# Altium project HV.PrjPcb
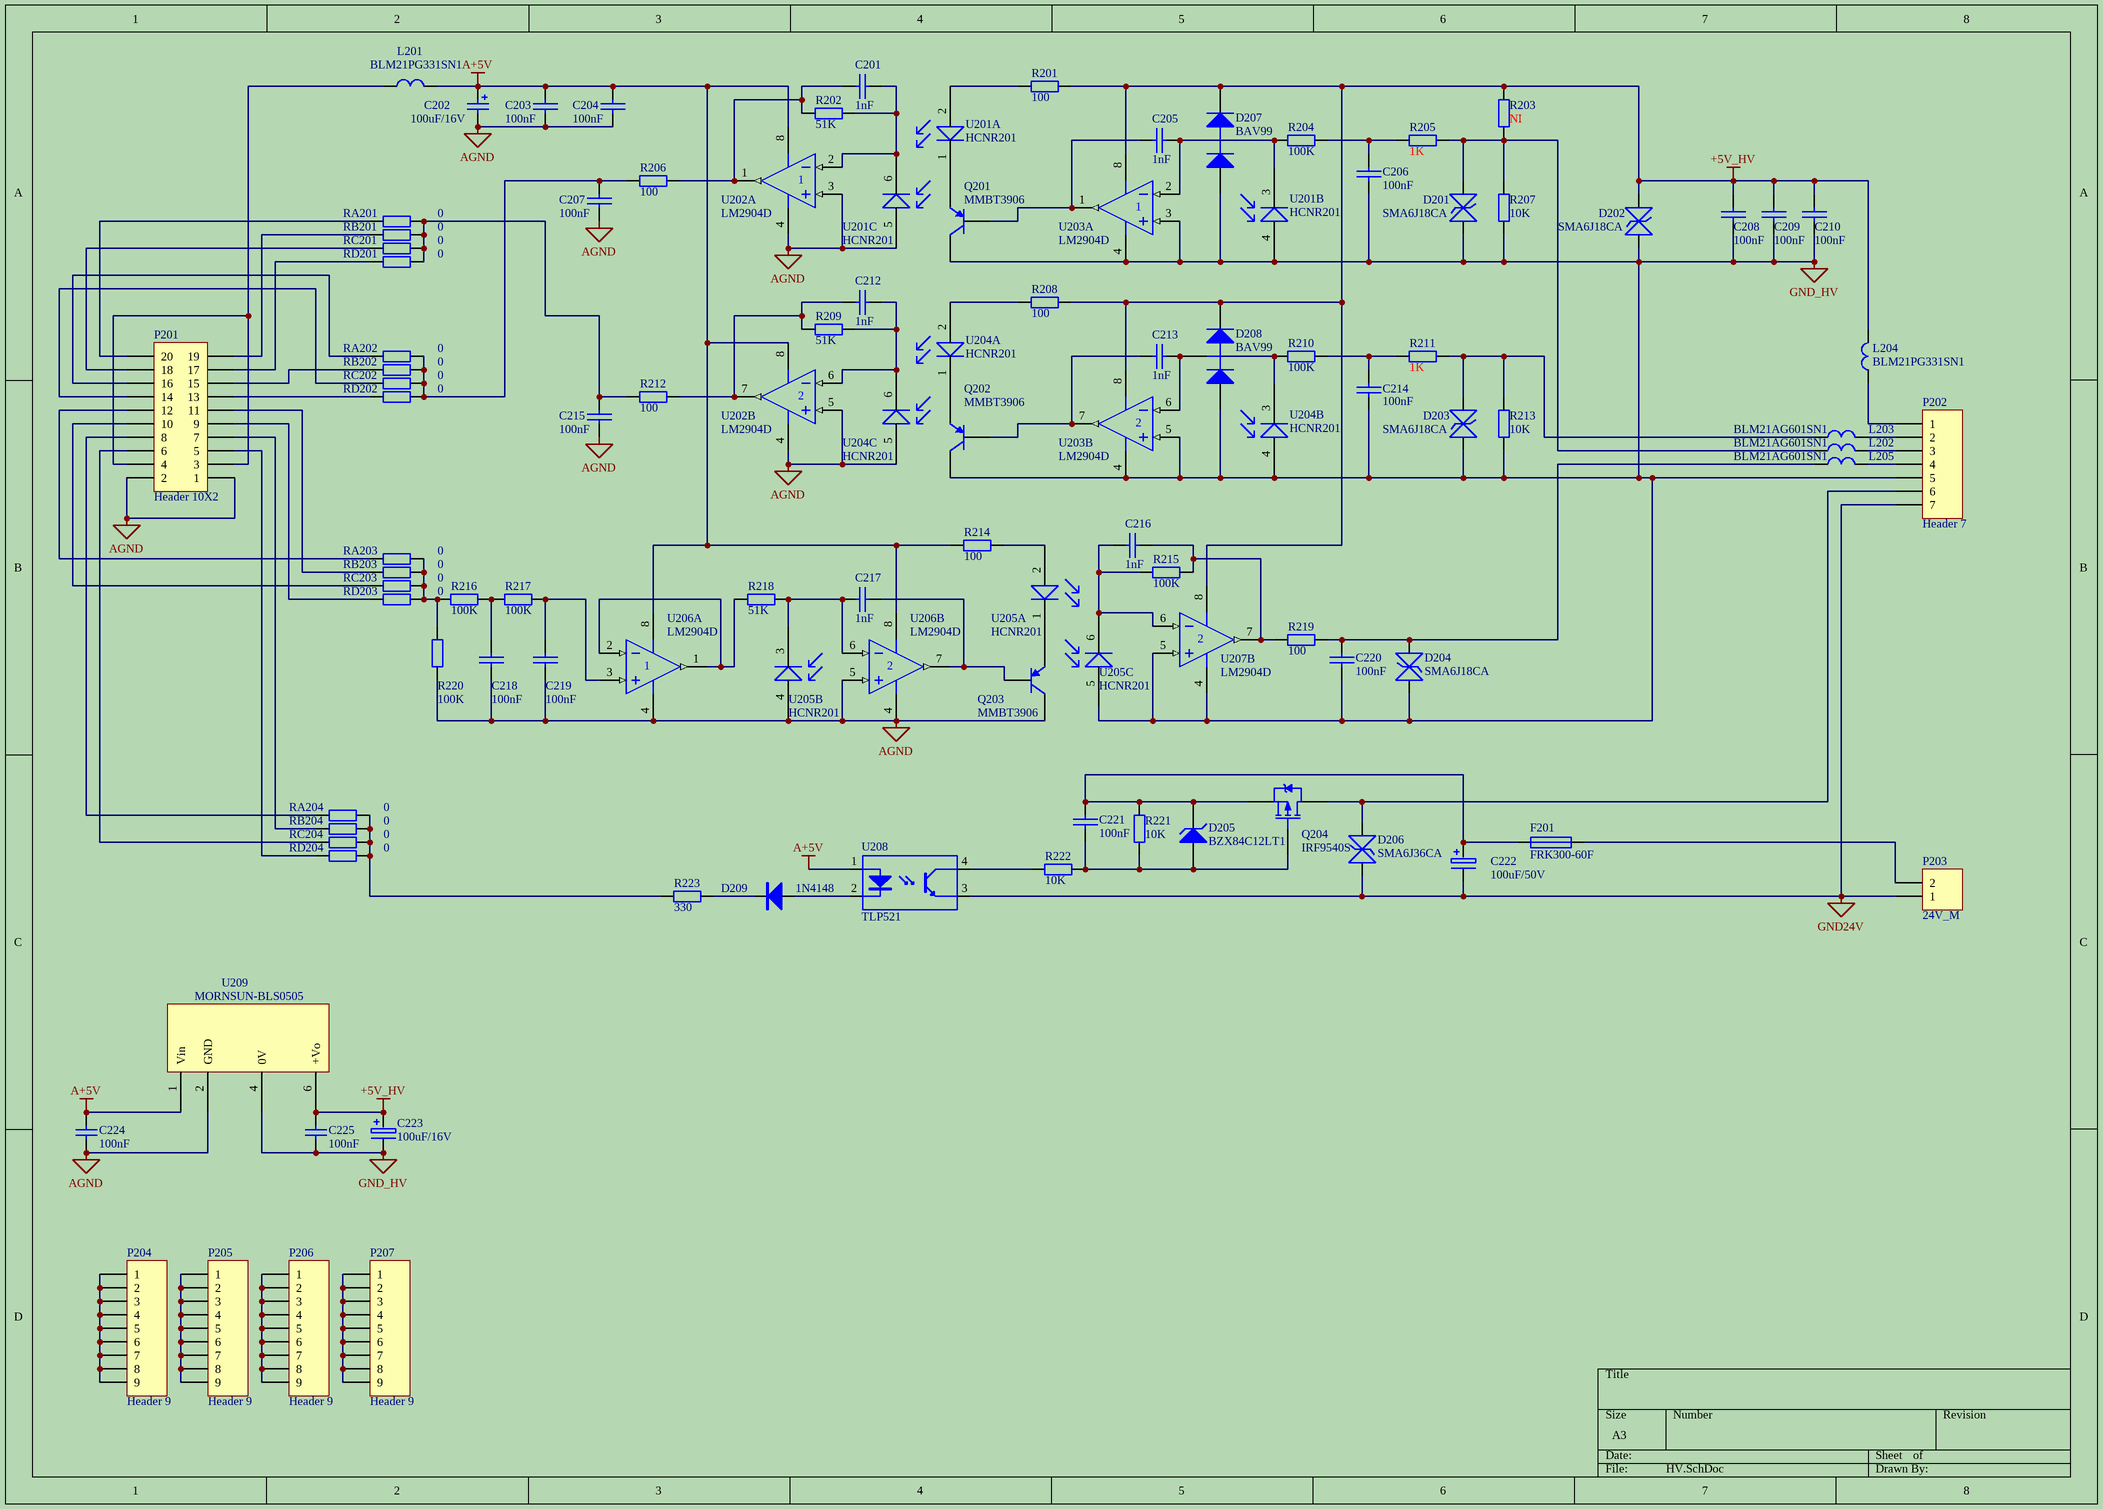
[diagram p0: HV.SchDoc]
1 sheet, 98 parts. Net scope: global (net labels, ports and power ports of the same name join across sheets).
Board file: HV.PcbDoc

## Sheet HV.SchDoc
size A3

### Parts
C201  1nF  [C0805]
C202  100uF/16V  [CD1/2]
C203  100nF  [C0805]
C204  100nF  [C0805]
C205  1nF  [C0805]
C206  100nF  [C0805]
C207  100nF  [C0805]
C208  100nF  [C0805]
C209  100nF  [C0805]
C210  100nF  [C0805]
C212  1nF  [C0805]
C213  1nF  [C0805]
C214  100nF  [C0805]
C215  100nF  [C0805]
C216  1nF  [C0805]
C217  1nF  [C0805]
C218  100nF  [C0805]
C219  100nF  [C0805]
C220  100nF  [C0805]
C221  100nF  [C0805]
C222  100uF/50V  [CD2/4]
C223  100uF/16V  [CD1/2]
C224  100nF  [C0805]
C225  100nF  [C0805]
D201  SMA6J18CA  [SMA]
D202  SMA6J18CA  [SMA]
D203  SMA6J18CA  [SMA]
D204  SMA6J18CA  [SMA]
D205  BZX84C12LT1  [318-07]
D206  SMA6J36CA  [SMA]
D207  BAV99  [SOT-23]
D208  BAV99  [SOT-23]
D209  1N4148  [D1206]
F201  FRK300-60F  [RAD-0.2]
L201  BLM21PG331SN1  [L0805]
L202  BLM21AG601SN1  [L0805]
L203  BLM21AG601SN1  [L0805]
L204  BLM21PG331SN1  [L0805]
L205  BLM21AG601SN1  [L0805]
P201  Header 10X2  [IDC20-EJ]
P202  Header 7  [3.96-7]
P203  24V_M  [3.96-2]
P204  Header 9  [LK]
P205  Header 9  [LK]
P206  Header 9  [LK]
P207  Header 9  [LK]
Q201  MMBT3906  [SOT23_N]
Q202  MMBT3906  [SOT23_N]
Q203  MMBT3906  [SOT23_N]
Q204  IRF9540S  [D2PAK_N]
R201  100  [R0805]
R202  51K  [R0805]
R203  NI  [R0805]
R204  100K  [R0805]
R205  1K  [R0805]
R206  100  [R0805]
R207  10K  [R0805]
R208  100  [R0805]
R209  51K  [R0805]
R210  100K  [R0805]
R211  1K  [R0805]
R212  100  [R0805]
R213  10K  [R0805]
R214  100  [R0805]
R215  100K  [R0805]
R216  100K  [R0805]
R217  100K  [R0805]
R218  51K  [R0805]
R219  100  [R0805]
R220  100K  [R0805]
R221  10K  [R0805]
R222  10K  [R0805]
R223  330  [R0805]
RA201  0  [R0805]
RA202  0  [R0805]
RA203  0  [R0805]
RA204  0  [R0805]
RB201  0  [R0805]
RB202  0  [R0805]
RB203  0  [R0805]
RB204  0  [R0805]
RC201  0  [R0805]
RC202  0  [R0805]
RC203  0  [R0805]
RC204  0  [R0805]
RD201  0  [R0805]
RD202  0  [R0805]
RD203  0  [R0805]
RD204  0  [R0805]
U201  HCNR201  [DIP-8-1]  (parts A,B,C of 3)
U202  LM2904D  [751-02_N]  (parts A,B of 2)
U203  LM2904D  [751-02_N]  (parts A,B of 2)
U204  HCNR201  [DIP-8-1]  (parts A,B,C of 3)
U205  HCNR201  [DIP-8-1]  (parts A,B,C of 3)
U206  LM2904D  [751-02_N]  (parts A,B of 2)
U207  LM2904D  [751-02_N]  (part B of 2)
U208  TLP521  [DIP4]
U209  MORNSUN-BLS0505  [MORNSUN-BLS]

### Nets
+5V_HV: C208.2 C209.2 C210.2 C223.1 C225.1 D202.1 D207.2(K) D208.2(K) L204.2 R201.1 R203.1 R208.1 U203.8(V+) U207.8(V+) U209.6(+Vo)
A+5V: C202.1 C203.2 C204.2 C224.1 L201.2 R214.1 U202.8(V+) U206.8(V+) U208.1(A) U209.1(Vin)
AGND: C202.2 C203.1 C204.1 C207.1 C215.1 C218.1 C219.1 C224.2 P201.1 P201.2 Q203.3(C) R220.1 U201.5(+) U202.3(IN+) U202.4(V-) U202.5(IN+) U204.5(+) U205.4(+) U206.4(V-) U206.5(IN+) U209.2(GND)
GND24V: C222.2 D206.2 P202.7 P203.1 U208.3(E)
GND_HV: C206.1 C208.1 C209.1 C210.1 C214.1 C220.1 C223.2 C225.2 D201.2 D202.2 D203.2 D204.2 D207.1(A) D208.1(A) P202.5 Q201.3(C) Q202.3(C) R207.1 R213.1 U201.4(+) U203.3(IN+) U203.4(V-) U203.5(IN+) U204.4(+) U205.5(+) U207.4(V-) U207.5(IN+) U209.4(0V)
NetC201_1: C201.1 R202.2 U201.6(-) U202.2(IN-)
NetC201_2: C201.2 R202.1 R206.1 U202.1(OUT)
NetC205_1: C205.1 D207.3(C) R204.1 U201.3(-) U203.2(IN-)
NetC205_2: C205.2 Q201.1(B) U203.1(OUT)
NetC206_2: C206.2 R204.2 R205.1
NetC207_2: C207.2 R206.2 RA202.1 RB202.1 RC202.1 RD202.1
NetC212_1: C212.1 R209.2 U202.6(IN-) U204.6(-)
NetC212_2: C212.2 R209.1 R212.1 U202.7(OUT)
NetC213_1: C213.1 D208.3(C) R210.1 U203.6(IN-) U204.3(-)
NetC213_2: C213.2 Q202.1(B) U203.7(OUT)
NetC214_2: C214.2 R210.2 R211.1
NetC215_2: C215.2 R212.2 RA201.1 RB201.1 RC201.1 RD201.1
NetC216_1: C216.1 R215.2 U205.6(-) U207.6(IN-)
NetC216_2: C216.2 R215.1 R219.1 U207.7(OUT)
NetC217_1: C217.1 R218.1 U205.3(-) U206.6(IN-)
NetC217_2: C217.2 Q203.1(B) U206.7(OUT)
NetC218_2: C218.2 R216.1 R217.2
NetC219_2: C219.2 R217.1 U206.3(IN+)
NetC220_2: C220.2 D204.1 L205.2 R219.2
NetC221_1: C221.1 D205.1(A) Q204.1(G) R221.1 R222.1
NetC221_2: C221.2 C222.1 D205.3(K) F201.2 Q204.3(S) R221.2
NetD201_1: D201.1 L202.1 R203.2 R205.2 R207.2
NetD203_1: D203.1 L203.1 R211.2 R213.2
NetD206_1: D206.1 P202.6 Q204.2(D)
NetD209_1: D209.1(A) U208.2(K)
NetD209_2: D209.2(K) R223.2
NetF201_1: F201.1 P203.2
NetL201_1: L201.1 P201.3 P201.4
NetL202_2: L202.2 P202.3
NetL203_2: L203.2 P202.2
NetL204_1: L204.1 P202.1
NetL205_1: L205.1 P202.4
NetP201_5: P201.5 RD204.2
NetP201_6: P201.6 RC204.2
NetP201_7: P201.7 RB204.2
NetP201_8: P201.8 RA204.2
NetP201_9: P201.9 RD203.2
NetP201_10: P201.10 RC203.2
NetP201_11: P201.11 RB203.2
NetP201_12: P201.12 RA203.2
NetP201_13: P201.13 RD202.2
NetP201_14: P201.14 RC202.2
NetP201_15: P201.15 RB202.2
NetP201_16: P201.16 RA202.2
NetP201_17: P201.17 RD201.2
NetP201_18: P201.18 RC201.2
NetP201_19: P201.19 RB201.2
NetP201_20: P201.20 RA201.2
NetP204_1: P204.1 P204.2 P204.3 P204.4 P204.5 P204.6 P204.7 P204.8 P204.9
NetP205_1: P205.1 P205.2 P205.3 P205.4 P205.5 P205.6 P205.7 P205.8 P205.9
NetP206_1: P206.1 P206.2 P206.3 P206.4 P206.5 P206.6 P206.7 P206.8 P206.9
NetP207_1: P207.1 P207.2 P207.3 P207.4 P207.5 P207.6 P207.7 P207.8 P207.9
NetQ201_2: Q201.2(E) U201.1(-)
NetQ202_2: Q202.2(E) U204.1(-)
NetQ203_2: Q203.2(E) U205.1(-)
NetR201_2: R201.2 U201.2(+)
NetR208_2: R208.2 U204.2(+)
NetR214_2: R214.2 U205.2(+)
NetR216_2: R216.2 R220.2 RA203.1 RB203.1 RC203.1 RD203.1
NetR218_2: R218.2 U206.1(OUT) U206.2(IN-)
NetR222_2: R222.2 U208.4(C)
NetR223_1: R223.1 RA204.1 RB204.1 RC204.1 RD204.1

### Library data of the parts
C201 C205 C212 C213 C216 C217 = CAP: Capacitor
C202 = Cap Pol2: Polarized Capacitor (Axial); Published: 8-Jun-2000; LatestRevisionDate: 17-Jul-2002; LatestRevisionNote: Re-released for DXP Platform.; PackageReference: POLAR0.8; Publisher: Altium Limited; PackageDescription: Polarized Capacitor; 2 Leads; Value: 100uF/16V
C203 C204 C206-C210 C214 C215 C218-C221 = CC: Capacitor
C222 C223 = CD1: Electrolytic Capacitor; Text Field1: 4.7uF:4V-A;6.3V-A;10V-A;16V-BA;20V-BA;25V-CB;35V-DC;50V-D;; Text Field2: 10uF:4V-AB;6.3V-BA;10V-BA;16V-CBA;20V-CB;25V-DC;35V-D;; Text Field3: 22uF:4V-BA;6.3V-CBA;10V-CB;16V-DBC;20V-DC;25V-D;35V-D;; Text Field4: 33uF:4V-CAB;6.3V-CBA;10V-DBC;16V-DCB;20V-DC;25V-DE;; Text Field5: 47uF:4V-CBA;6.3V-DBC;10V-DBC;16V-DC;20V-DE;; Text Field6: 68uF:4V-DBC;6.3V-DCB;10V-DCB;16V-D;20V-DE;; Text Field7: 100uF:4V-DCB;6.3V-EDBC;10V-DC;16V-DE;20V-E;; Text Field8: 220uF:4V-EDC;6.3V-ED;10V-ED;
C224 C225 = Cap: Capacitor; Published: 8-Jun-2000; LatestRevisionDate: 17-Jul-2002; LatestRevisionNote: Re-released for DXP Platform.; PackageReference: RAD-0.3; Publisher: Altium Limited; Value: 100nF
D201-D204 D206 = TVS
D205 = BZX84C12LT1: Zener Voltage Regulator Diode; Note: Pin 2 is not connected and not drawn.; Published: 29-Sep-2000; LatestRevisionDate: 17-Jul-2002; LatestRevisionNote: Re-released for DXP Platform.; PackageReference: 318-07; Publisher: Altium Limited; PackageDescription: SOT-23; 3 Leads; Body 3.0 x 2.5 mm, inc. leads (LxW max); ComponentLink1Description: Manufacturer Link; ComponentLink1URL: http://www.onsemi.com/site/products/landing?taxonomyID=194; ComponentLink2Description: Datasheet; ComponentLink2URL: http://www.onsemi.com/pub/Collateral/BZX84C2V4LT1-D.PDF
D207 D208 = BAV99: Silicon Switching Diode Array for High-Speed Switching; Published: 21-Mar-2003; DatasheetDocument: Oct-1999; PackageDocument: Sep-2001; PackageReference: SOT-23; Publisher: Altium Limited; ComponentLink1Description: Manufacturer Link; ComponentLink1URL: http://www.infineon.com/; ComponentLink2Description: Datasheet; ComponentLink2URL: http://www.infineon.com/upload/Document/cmc_upload/documents/080/631/bav99series_1.pdf
D209 = 2JG
F201 = FUSE1: Fuse
L201-L205 = L1
P201 = Header 10X2: Header, 10-Pin, Dual row; LatestRevisionDate: 17-Jul-2002; LatestRevisionNote: Re-released for DXP Platform.; Publisher: Altium Limited
P202 = Header 7: Header, 7-Pin; LatestRevisionDate: 17-Jul-2002; LatestRevisionNote: Re-released for DXP Platform.; Publisher: Altium Limited
P203 = Header 2: Header, 2-Pin; LatestRevisionDate: 17-Jul-2002; LatestRevisionNote: Re-released for DXP Platform.; Publisher: Altium Limited
P204-P207 = Header 9: Header, 9-Pin; LatestRevisionDate: 17-Jul-2002; LatestRevisionNote: Re-released for DXP Platform.; Publisher: Altium Limited
Q201-Q203 = MMBT3906: PNP Switching Transistor; Published: 17-Sep-2003; LatestRevisionDate: 12-Dec-2006; LatestRevisionNote: IPC-7351 Footprint Added.; DatasheetVersion: 11-Apr-2000; PackageVersion: May-1999; PackageReference: SOT23; Publisher: Altium Limited; PackageDescription: 3-Pin SOT-23 Package 0.95 mm Pitch, 2.3 mm Lead Span; ComponentLink1Description: Manufacturer Link; ComponentLink1URL: http://www.semiconductors.philips.com/; ComponentLink2Description: Datasheet; ComponentLink2URL: http://www.semiconductors.philips.com/acrobat/datasheets/MMBT3906_2.pdf
Q204 = IRF9540S: HEXFET P-Channel Power MOSFET; Published: 8-Jun-2000; LatestRevisionDate: 20-Nov-2009; LatestRevisionNote: IPC-7351 Footprint Added.; DatasheetVersion: PD-9.917; PackageReference: D2PAK; Publisher: Altium Limited; PackageDescription: 3-Pin Transistor Outline Package 2.54 mm Pitch, 15.1 mm Lead Span; ComponentLink1Description: Manufacturer Link; ComponentLink1URL: http://www.irf.com/; ComponentLink2Description: Datasheet; ComponentLink2URL: http://www.irf.com/product-info/datasheets/data/irf9540s.pdf
R201-R204 R206-R210 R212-R223 RA201-RA204 RB201-RB204 RC201-RC204 RD201-RD204 = Res2: Resistor; Value: 1K; Published: 8-Jun-2000; LatestRevisionDate: 17-Jul-2002; LatestRevisionNote: Re-released for DXP Platform.; PackageReference: AXIAL-0.4; Publisher: Altium Limited
R205 R211 = Res2: Resistor; Published: 8-Jun-2000; LatestRevisionDate: 17-Jul-2002; LatestRevisionNote: Re-released for DXP Platform.; PackageReference: AXIAL-0.4; Publisher: Altium Limited; Value: 1K
U202 U203 U206 U207 = LM2904D: Dual Low-Power Operational Amplifier; Published: 17-Jul-2002; LatestRevisionDate: 13-Apr-2006; LatestRevisionNote: IPC-7351 Footprint Added.; DatasheetVersion: 1988; PackageReference: 751-02; Publisher: Altium Limited; PackageDescription: 8-Pin Small Outline Integrated Circuit 1.27 mm Pitch; Code_JEDEC: MS-012-AA; Code_IPC: SOIC127P600-8; ComponentLink1Description: Manufacturer Link; ComponentLink1URL: http://www.onsemi.com/site/products/parametrics/0,4446,251,00.html; ComponentLink2Description: Datasheet; ComponentLink2URL: http://www.onsemi.com/pub/Collateral/LM358-D.PDF
U208 = TLP521: Text Field1: 80; Text Field2: 50
U209 = MORNSUN-BLS: MORNSUN Fixed input,Isolated,Unregulated Series DC/DC